# Altium schematic sheet LB - Supply.SchDoc
size A4
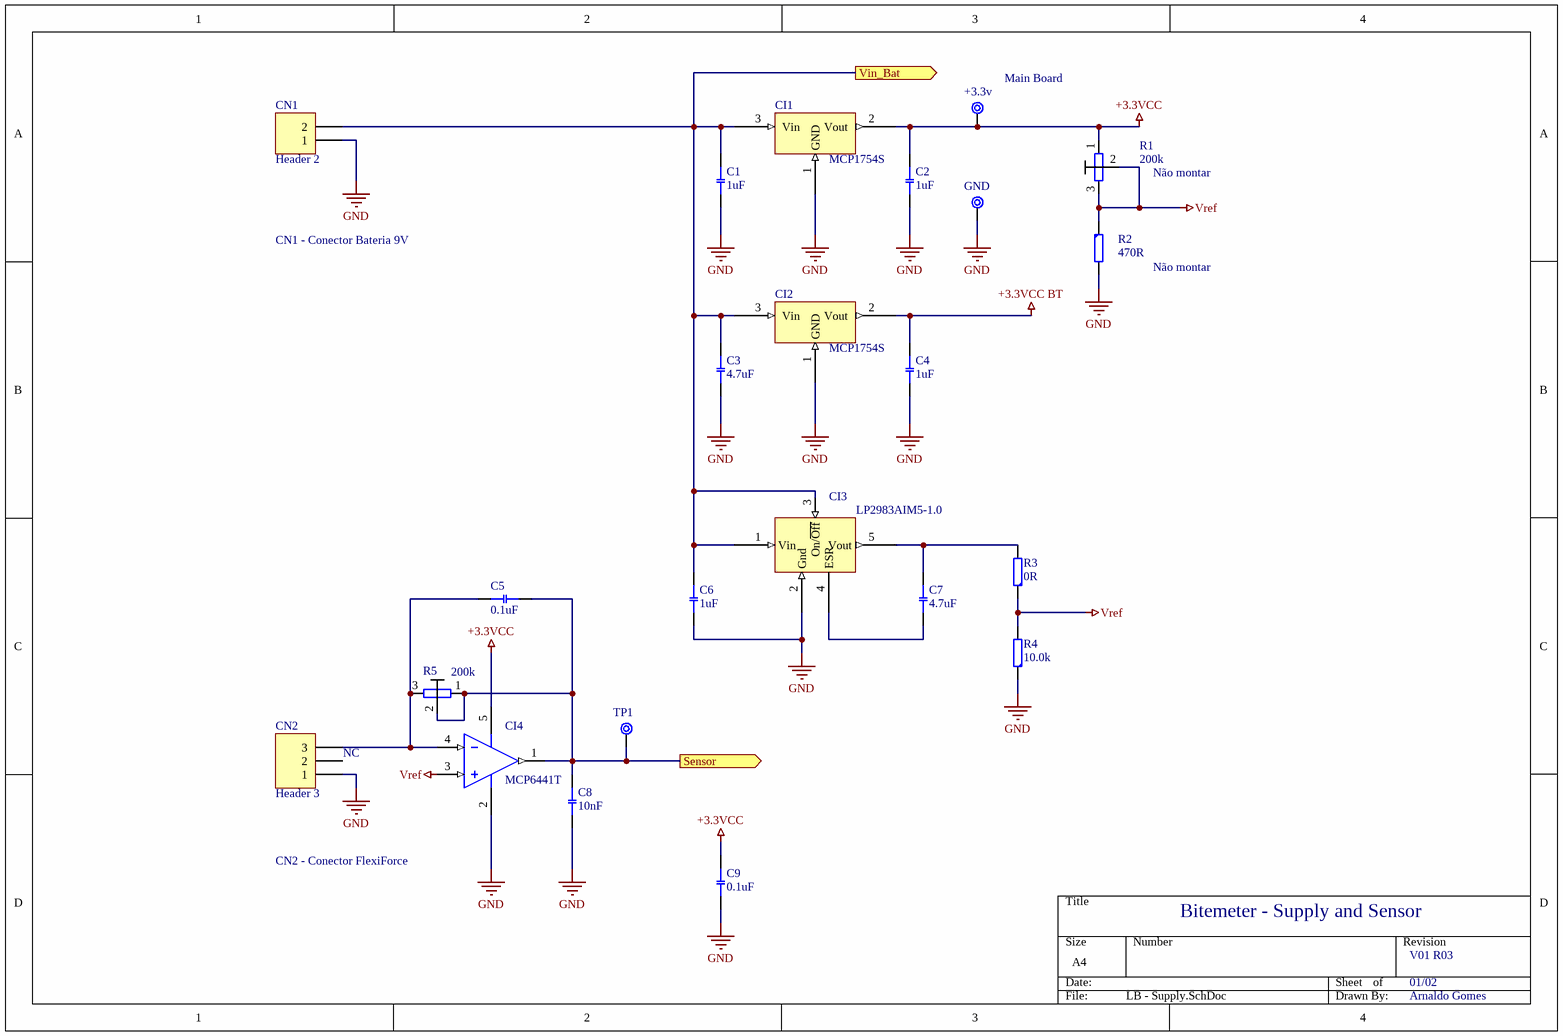
[diagram p0: LB - Supply.SchDoc]

## Parts
+3.3v  TP  [TPSMD]  (value not drawn)  (no BOM)
C1  1uF  [R0805]
C2  1uF  [R0805]
C3  4.7uF  [R0805]
C4  1uF  [R0805]
C5  0.1uF  [R0805]
C6  1uF  [R0805]
C7  4.7uF  [R0805]
C8  10nF  [R0805]
C9  0.1uF  [R0805]
CI1  MCP1754S  [SOT23-A MCP1754]
CI2  MCP1754S  [SOT23-A MCP1754]
CI3  LP2983AIM5-1.0  [SOT23-5 Amp Op]
CI4  MCP6441T  [SOT23-5 Amp Op]
CN1  Header 2  [HDR1X2]
CN2  Header 3  [HDR1X3]
GND  TP  [TPSMD]  (value not drawn)  (no BOM)
R1  200k  [3364X-1-503E]
R2  470R  [R0805]
R3  0R  [R0805]
R4  10.0k  [R0805]
R5  200k  [3364X-1-503E]
TP1  TP  [TPSMD]  (value not drawn)  (no BOM)

## Ports
Sensor (out), Vin_Bat (out)

## Nets
+3.3VCC: +3.3v.1 C2.2(B) C9.2(B) CI1.2(Vout) CI4.5(VDD) R1.1(B)
+3.3VCC BT: C4.2(B) CI2.2(Vout)
GND: C1.1(A) C2.1(A) C3.1(A) C4.1(A) C6.2(B) C8.1(A) C9.1(A) CI1.1(GND) CI2.1(GND) CI3.2(Gnd) CI4.2(VSS) CN1.1 CN2.1 GND.1 R2.2(B) R4.1(A)
Vref: CI4.3(Vin+) R1.2(C) R1.3(A) R2.1(A) R3.1(A) R4.2(B)
Sensor: C5.1(A) C8.2(B) CI4.1(Vout) R5.1(B) R5.2(C) TP1.1 ; port Sensor
Vin_Bat: C1.2(B) C3.2(B) C6.1(A) CI1.3(Vin) CI2.3(Vin) CI3.1(Vin) CI3.3(On/~{Off}) CN1.2 ; port Vin_Bat
NetC5_2: C5.2(B) CI4.4(Vin-) CN2.3 R5.3(A)
NetC7_1: C7.1(A) CI3.4(ESR)
NetC7_2: C7.2(B) CI3.5(Vout) R3.2(B)

Not connected (* = marked no-connect by the designer): CN2 2

## Notes on the sheet
- (near +3.3v) Main Board
- (near R1) Não montar
- CN1 - Conector Bateria 9V
- Não montar
- (near CN2) NC
- CN2 - Conector FlexiForce
- Bitemeter - Supply and Sensor
- V01 R03
- 01/02
- Arnaldo Gomes

## Library data of the parts
+3.3v GND TP1 = TP: Test Point
C1 = C: Capictor Cerâmico 4.7uFx16V; PN_Fab: C2012X7R1C105K125AA; PN_For: 445-1358-1-ND; Ref_Fab: TDK Corporation; Ref_For: Digikey
C2 C4 C6 = C: Capictor Cerâmico 1uFx16V; PN_Fab: C2012X7R1C105K125AA; PN_For: 445-1358-1-ND; Ref_Fab: TDK Corporation; Ref_For: Digikey
C3 C7 = C: Capictor Cerâmico 4.7uFx16V; PN_Fab: C2012X7R1C475K125AB; PN_For: 445-6859-1-ND; Ref_Fab: TDK Corporation; Ref_For: Digikey
C5 C9 = C: Capacitor 0.1uFx25V; PN_Fab: C2012X7R1H104K085AA; PN_For: 445-7534-1-ND; Ref_Fab: Murata Electronics North America; Ref_For: Digikey
C8 = C: Capacitor 10nFx25V; PN_Fab: C2012C0G1H103K060AA; PN_For: 445-14311-1-ND; Ref_Fab: TDK Corporation; Ref_For: Digikey
CI1 CI2 = Regulador 3.3V - SOT223-3, 4-Leads, Body 6.50x7.00mm (avg), Pitch 2.30mm, IPC Medium_1: Regulador 3.3V MCP1754S; PN_Fab: MCP1754ST-3302E/CB; PN_For: MCP1754ST-3302E/CBCT-ND; Ref_Fab: Microchip Technology; Ref_For: Digikey
CI3 = Regulador 1.0V - SOT23-5: Regulador 1.0V; LP2983AIM5-1.0/NOPB: PN_Fab; LP2983AIM5-1.0/NOPBCT-ND: PN_For; Texas Instruments: Ref_Fab; Digikey: Ref_For
CI4 = Amp Op: Amp Op Rail-to-Rail; PN_Fab: MCP6441T-E/OT; PN_For: MCP6441T-E/OTCT-ND; Ref_Fab: Linear Technology; Ref_For: Digikey
CN1 = Conector Alimentação: Header, 2-Pin; Ref_Fab: TE Connectivity; Ref_For: Digikey; PN_Fab: 640456-2; PN_For: A1921-ND
CN2 = Conector Sensor: Header, 3-Pin; PN_Fab: 640457-3; PN_For: A19480-ND; Ref_For: TE Connectivity; Ref_For: Digikey
R1 = Trimpot: Trimpot 200k; PN_Fab: 3364X-1-204E; PN_For: 3364X-204ETR-ND; Ref_Fab: Bourns Inc.; Ref_For: Digikey
R2 = R: PN_Fab: MCR10ERTJ471; PN_For: RHM470CPCT-ND; Ref_Fab: Rohm Semiconductor; Ref_For: Digikey
R3 = R: PN_Fab: RHM0.0CPCT-ND; PN_For: MCR10ERTJ000; Ref_Fab: Rohm Semiconductor; Ref_For: Digikey
R4 = R: PN_Fab: MCR10ERTF1002; PN_For: RHM10.0KCHCT-ND; Ref_Fab: Rohm Semiconductor; Ref_For: Digikey
R5 = Trimpot: Trimpot 500k; PN_Fab: 3364X-1-504E; PN_For: 3364X-504ECT-ND; Ref_Fab: Bourns Inc.; Ref_For: Digikey